# EAGLE design VertMount (EAGLE 9.6.2)
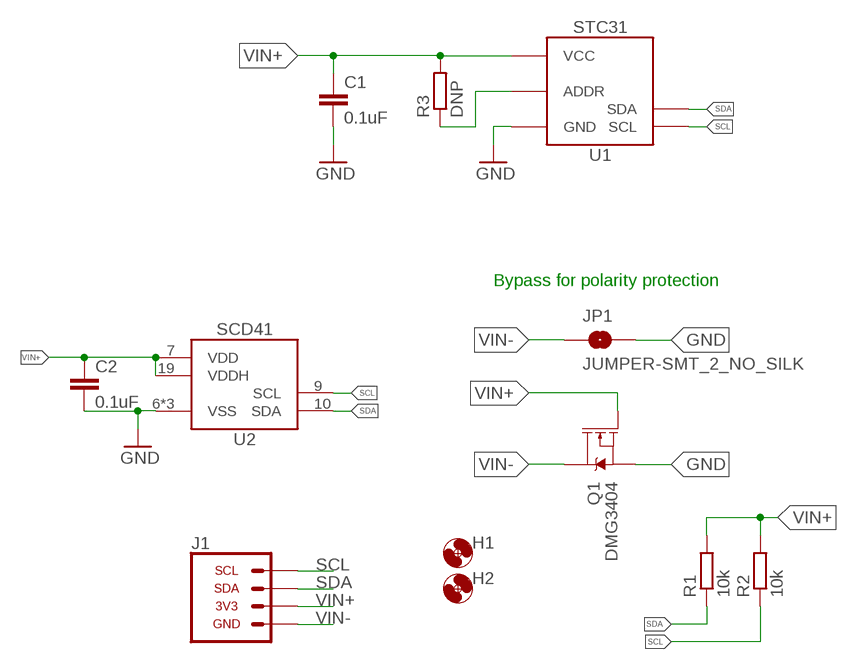
[diagram p0: schematic, sheet 1]

## Parts
C1  0.1uF  C-EU0.1UFC0603  [C0603]
C2  0.1uF  C-EU0.1UFC0603  [C0603]
H1  MOUNTING_HOLE1_NP  [1_72]
H2  MOUNTING_HOLE1_NP  [1_72]
J1  CONN_I2C_SENSOR_BOARD_MOUNT_TH  [1X04_M12_TE_T41400]
JP1  JUMPER-SMT_2_NO_SILK  [SMT-JUMPER_2_NO_SILK]
Q1  DMG3404  MOSFET-NCH-DMG3404L  [SOT23-3]
R1  10k  R-EU_10KR0603  [R0603]
R2  10k  R-EU_10KR0603  [R0603]
R3  DNP  R-EU_R0603  [R0603]
U1  STC31  [STC31]
U2  SCD41  [SCD4X]

## Nets
GND: C1.2 C2.2 JP1.2 Q1.2(S) U1.1(GND) U1.5(GND) U1.9(GND) U1.11(GND) U1.EP(GND) U2.6(VSS) U2.20(VSS) U2.EP(VSS)
N$2: R3.1 U1.3(ADDR)
SCL: J1.3(SCL) R2.1 U1.4(SCL) U2.9(SCL)
SDA: J1.1(SDA) R1.1 U1.7(SDA) U2.10(SDA)
VIN+: C1.1 C2.1 J1.2(3V3) Q1.1(G) R1.2 R2.2 R3.2 U1.6(VCC) U2.7(VDD) U2.19(VDDH)
VIN-: J1.4(GND) JP1.1 Q1.3(D)

## Notes on the sheet
- Bypass for polarity protection

## Library data of the parts
C1 C2 = bschulz_passives:C-EU: CAPACITOR, European symbol; DIGIKEY: 490-6051-1-ND; MF: Murata; MPN: GCM188R71E104KA57D
H1 H2 = bschulz:MOUNTING_HOLE: Genaric Mechanical Mounting Hole Hole diameter based on max body diameter + 15% Keepout ring is for diameter of socket cap screw (minimum required clearance) TPlace ring is for diameter of pan head screw (recomended clearance) Specifications: Socket Cap <http://fastener-express.com/fastener-technical/SocketscapSS-Alloy.pdf> Button Head Socket Cap <http://fastener-express.com/fastener-technical/Button-Socket-alloy.pdf> Pan Head <http://fastener-express.com/fastener-technical/pan-machine-Screws.pdf>; DIGIKEY: DNP; MF: N/A; MPN: DNP
J1 = GEMS_Plugs:CONN_I2C_SENSOR: GEMS Connector for I2C Devices - Sensor Side; DIGIKEY: A124956-ND; MF: TE; MPN: T4140012041-000
JP1 = bschulz:JUMPER-SMT_2_NO: Normally open jumper This jumper has two pads in close proximity to each other. Apply solder to close the connection. Round pads are easier to solder for beginners, but are a lot larger. SparkFun Product that uses the round pads: SparkFun EL Sequencer <https://www.sparkfun.com/products/12781>; DIGIKEY: DNP; MF: N/A; MPN: N/A
Q1 = bschulz:MOSFET-NCH: N-channel MOSFETs Voltage controlled devices that allow control of high current outputs. SparkFun Products: SparkFun OpenScale <https://www.sparkfun.com/products/13261> SparkFun Digital Sandbox <https://www.sparkfun.com/products/12651> SparkFun Monster Moto Shield <https://www.sparkfun.com/products/10182> SparkFun MOSFET Power Controller <https://www.sparkfun.com/products/11214>; DIGIKEY: DMG3404L-7DICT-ND; MF: Diodes Incorporated; MPN: DMG3404L-7
R1 R2 = bschulz_passives:R-EU_: RESISTOR, European symbol Digikey Parts: Yageo, 0402 <https://www.digikey.com/products/en/resistors/chip-resistor-surface-mount/52?k=&pkeyword=&sv=0&s=4356&sf=1&FV=-1%7C13%2C7%7C2%2C1291%7C39157%2C1989%7C0%2C-8%7C52%2C3%7C1131%2C3%7C2503&quantity=&ColumnSort=0&page=1&stock=1&pageSize=25> Yageo, 0603 <https://www.digikey.com/products/en/resistors/chip-resistor-surface-mount/52?k=&pkeyword=&sv=0&pv1291=39245&sf=1&FV=-5%7C4356%2C-5%7C47360%2C-8%7C52%2C-1%7C13%2C7%7C2%2C1989%7C0&quantity=10&ColumnSort=1000011&page=1&stock=1&pageSize=25> Panasonic, 0603 <https://www.digikey.com/products/en/resistors/chip-resistor-surface-mount/52?k=&pkeyword=&pv252=68&sf=0&FV=ffec373d%2C1c0002%2C142c040c%2C1f140000%2Cffe00034%2C80002%2Cc0001&quantity=&ColumnSort=0&page=1&stock=1&pageSize=25> Panasonic, precision, 0603 <https://www.digikey.com/products/en/resistors/chip-resistor-surface-mount/52?FV=ffec4907%2Cfffc000a%2Cc0172%2C142c040c%2C1f140000%2Cffe00034%2C1c0002&quantity=100&ColumnSort=2085&page=1&stock=1&pageSize=25> Panasonic, 0805 <https://www.digikey.com/products/en/resistors/chip-resistor-surface-mount/52?k=&pkeyword=&pv3=1&sf=0&FV=ffec373d%2C1c0002%2C1f140000%2Cffe00034%2C142c040d&quantity=&ColumnSort=0&page=1&stock=1&pageSize=25> Rohm, current sense <https://www.digikey.com/products/en/resistors/chip-resistor-surface-mount/52?k=&pkeyword=&pv3=1&sf=0&FV=ffecb688%2C1f140000%2Cffe00034%2C1c0002&quantity=&ColumnSort=0&page=1&stock=1&pageSize=25> Vishay, pulse proof automotive <https://www.digikey.com/products/en/resistors/chip-resistor-surface-mount/52?k=&pkeyword=&pv7=2&sf=0&FV=ffec5d6b%2Cffe00034%2C1f140000&quantity=&ColumnSort=0&page=1&stock=1&pageSize=25>; DIGIKEY: 311-10.0KHRCT-ND; MF: Yageo; MPN: RC0603FR-0710KL; VALUE_PART: 10k
R3 = bschulz_passives:R-EU_: RESISTOR, European symbol Digikey Parts: Yageo, 0402 <https://www.digikey.com/products/en/resistors/chip-resistor-surface-mount/52?k=&pkeyword=&sv=0&s=4356&sf=1&FV=-1%7C13%2C7%7C2%2C1291%7C39157%2C1989%7C0%2C-8%7C52%2C3%7C1131%2C3%7C2503&quantity=&ColumnSort=0&page=1&stock=1&pageSize=25> Yageo, 0603 <https://www.digikey.com/products/en/resistors/chip-resistor-surface-mount/52?k=&pkeyword=&sv=0&pv1291=39245&sf=1&FV=-5%7C4356%2C-5%7C47360%2C-8%7C52%2C-1%7C13%2C7%7C2%2C1989%7C0&quantity=10&ColumnSort=1000011&page=1&stock=1&pageSize=25> Panasonic, 0603 <https://www.digikey.com/products/en/resistors/chip-resistor-surface-mount/52?k=&pkeyword=&pv252=68&sf=0&FV=ffec373d%2C1c0002%2C142c040c%2C1f140000%2Cffe00034%2C80002%2Cc0001&quantity=&ColumnSort=0&page=1&stock=1&pageSize=25> Panasonic, precision, 0603 <https://www.digikey.com/products/en/resistors/chip-resistor-surface-mount/52?FV=ffec4907%2Cfffc000a%2Cc0172%2C142c040c%2C1f140000%2Cffe00034%2C1c0002&quantity=100&ColumnSort=2085&page=1&stock=1&pageSize=25> Panasonic, 0805 <https://www.digikey.com/products/en/resistors/chip-resistor-surface-mount/52?k=&pkeyword=&pv3=1&sf=0&FV=ffec373d%2C1c0002%2C1f140000%2Cffe00034%2C142c040d&quantity=&ColumnSort=0&page=1&stock=1&pageSize=25> Rohm, current sense <https://www.digikey.com/products/en/resistors/chip-resistor-surface-mount/52?k=&pkeyword=&pv3=1&sf=0&FV=ffecb688%2C1f140000%2Cffe00034%2C1c0002&quantity=&ColumnSort=0&page=1&stock=1&pageSize=25> Vishay, pulse proof automotive <https://www.digikey.com/products/en/resistors/chip-resistor-surface-mount/52?k=&pkeyword=&pv7=2&sf=0&FV=ffec5d6b%2Cffe00034%2C1f140000&quantity=&ColumnSort=0&page=1&stock=1&pageSize=25>; MF: Yageo
U1 = bschulz:STC31: STC31 - Thermal Conductivity CO2 Gas Sensor Sensor Characteristics: Vcc: 2.7 ~ 5.5V Sensing: CO2, Temperature Range: 0 ~ 100% (CO2) Sample Rate: >1Hz Operating Temperature: -40°C to 105°C Digikey: 1649-STC31-C-R3CT-ND <https://www.digikey.com/en/products/detail/sensirion-ag/STC31-C-R3/24394079>; DIGIKEY: 1649-STC31-C-R3CT-ND; DISP: STC31; MF: Sensirion; MPN: STC31-C-R3
U2 = bschulz:SCD4*: SCD4x - Miniature NDIR CO2 Sensor Characteristics: Vcc: 2.4 ~ 5.5V Sensing: CO2, Temperature, Humidity Range: 0 ~ 40000 ppm (CO2) Sample Rate: <5s Operating Temperature: -10°C to 60°C Digikey: 1649-SCD40-D-R2CT-ND <https://www.digikey.com/en/products/detail/sensirion-ag/SCD40-D-R2/13684003> 1649-SCD41-D-R2CT-ND <https://www.digikey.com/en/products/detail/sensirion-ag/SCD41-D-R2/13684005>; DIGIKEY: 1649-SCD41-D-R2CT-ND; DISP: SCD41; MF: Sensirion; MPN: SCD41-D-R2

## Board
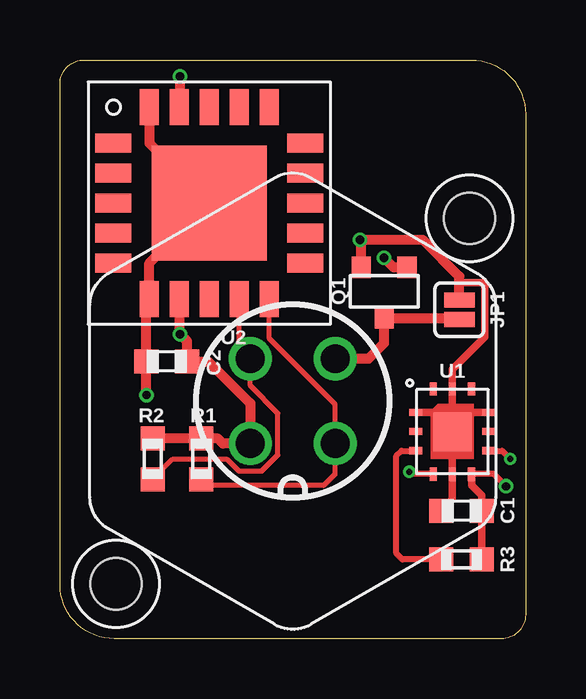
[diagram p1: board, top side]
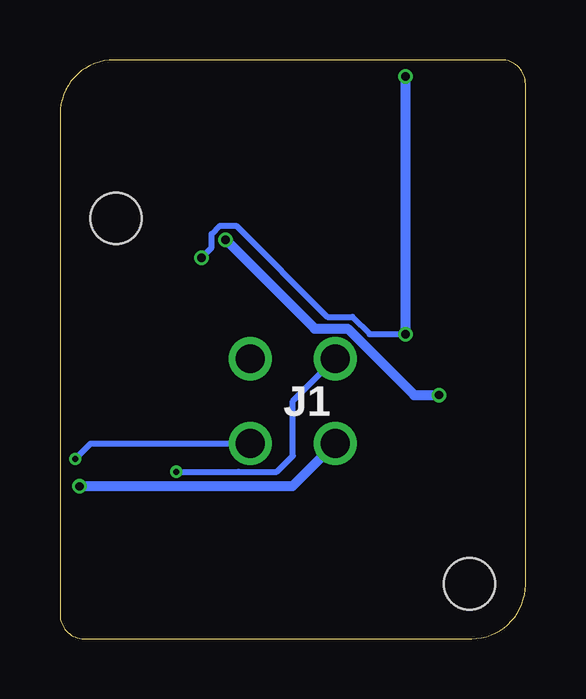
[diagram p2: board, bottom side, seen from below]

Size 19.4 x 24.13 mm. Coordinates in mm from the lower left corner, seen from the top.
Outline: 19.4,21.88 19.4,1 arc-90 18.4,0 2.25,0 arc-90 0,2.25 0,23.13 arc-90 1,24.13 17.15,24.13 arc-90 19.4,21.88
Copper layers (1*16): Top 0.035559375mm / dielectric 1.6mm / Bottom 0.035559375mm
Design rules "jlcpcb-2layer": minimum track width 5mil, minimum drill 0.2mm, track to track 5mil, track to pad 6mil, pad to pad 5mil, via to via 6mil, smd to smd 5mil, copper to edge 15mil, drill to drill 6mil, minimum pad ring 5mil, minimum via ring 5mil, stop-mask expansion 2.5mil, vias tented up to drill 0mil, thermal gap 10mil

### Footprints (pad centres in the part's own frame; a part is rotated, then mirrored left to right if it is on the bottom)
C0603 = smd 1 x 1: 1 -0.85,0; 2 0.85,0
1_72 = hole 2.132: 0,0
1X04_M12_TE_T41400 = drill 1.2: 1 1.768,1.768; 2 -1.768,1.768; 3 -1.768,-1.768; 4 1.768,-1.768
SMT-JUMPER_2_NO_SILK = smd 0.635 x 1.27: 1 -0.406,0; 2 0.406,0
SOT23-3 = smd 0.8 x 0.9: 1 -0.95,-1; 2 0.95,-1; 3 0,1.1
R0603 = smd 1 x 1: 1 -0.85,0; 2 0.85,0
STC31 = smd 0.55 x 0.3: 1 -1.525,0.8; 2 -1.525,0; 3 -1.525,-0.8; 7 1.525,-0.8; 8 1.525,0; 9 1.525,0.8 | smd 0.3 x 0.55: 4 -0.8,-1.775; 5 0,-1.775; 6 0.8,-1.775; 10 0.8,1.775; 11 0,1.775; 12 -0.8,1.775 | smd 1.6 x 1.6: EP 0,0
SCD4X = smd 1.5 x 0.8: 1 -4,2.5; 2 -4,1.25; 3 -4,0; 4 -4,-1.25; 5 -4,-2.5; 11 4,-2.5; 12 4,-1.25; 13 4,0; 14 4,1.25; 15 4,2.5 | smd 0.8 x 1.5: 6 -2.5,-4; 7 -1.25,-4; 8 0,-4; 9 1.25,-4; 10 2.5,-4; 16 2.5,4; 17 1.25,4; 18 0,4; 19 -1.25,4; 20 -2.5,4 | smd 4.8 x 4.8: EP 0,0

### Placement (x,y rotation side)
C1  16.73,5.33 180 top
C2  4.45,11.56 180 top
H1  17.06,17.53 0 top
H2  2.33,2.29 0 top
J1  9.7,9.91 180 bottom
JP1  16.64,13.72 90 top
Q1  13.51,14.48 180 top
R1  5.89,7.49 90 top
R2  3.86,7.49 90 top
R3  16.73,3.3 0 top
U1  16.35,8.64 0 top
U2  6.22,18.16 0 top

### Tracks (layer width: path | path; a pad name or v marks a point on that pad's centre or on a via)
GND  (via drill 0.35)
  Top 0.305: C1.2 16.35,5.8 U1.5 U1.EP | U1.1 15.55,9.44 U1.EP | U1.EP U1.11 16.35,11.22 17.7,12.57 17.7,14.73 17.57,14.86 16.64,14.86 | U1.9 17.15,9.44 U1.EP
  Top 0.406: U2.20 3.72,20.66 U2.EP 3.72,15.66 U2.6 3.6,14.03 C2.2 v3.6,10.16 | Q1.2 12.56,16.57 v12.49,16.64 15.11,16.64 16.64,15.11 16.64,14.86 JP1.2
  Bottom 0.406: v12.49,16.64 8.78,12.93 7.41,12.93 4.64,10.16 v3.6,10.16
N$2
  Top 0.254: R3.1 14.27,3.3 14.02,3.56 14.02,7.62 14.23,7.84 U1.3
SCL  (via drill 0.25)
  Top 0.2: U2.9 7.47,12.13 J1.3 7.93,10.55 9.08,9.4 9.08,7.66 8.41,6.99 8.05,6.99 7.45,6.99 6.95,7.49 4.71,7.49 R2.1
  Top 0.254: U1.4 14.65,6.86 v14.55,6.96
  Bottom 0.254: v14.55,6.96 11.96,6.96 11.95,6.96 10.36,6.96 9.7,7.62 9.7,9.91 J1.3
SDA  (via drill 0.25)
  Top 0.2: U2.10 8.72,12.51 11.47,9.77 J1.1 11.47,6.87 10.99,6.39 6.14,6.39 R1.1
  Top 0.254: U1.7 18.42,7.84 v18.76,7.49
  Bottom 0.254: v18.76,7.49 18.12,8.14 J1.1
VIN+  (via drill 0.35)
  Top 0.254: v18.59,6.35 18.08,6.86 U1.6
  Top 0.305: R3.2 C1.1 17.58,5.97 17.15,6.4 U1.6
  Top 0.406: R2.2 R1.2 6.58,8.34 6.79,8.14 J1.2 7.93,9.81 6.18,11.56 C2.1 5.3,12.4 v5,12.7 5,14.13 U2.7 | v5,23.45 5,22.19 U2.19 | Q1.1 13.91,15.48 v13.51,15.88
  Bottom 0.254: v13.51,15.88 13.07,16.31 13.07,16.88 12.73,17.22 12.06,17.22 8.25,13.41 7.21,13.41 6.5,12.7 v5,12.7
  Bottom 0.406: v5,12.7 v5,23.45 | J1.2 9.72,6.35 v18.59,6.35
VIN-
  Top 0.406: J1.4 12.86,11.67 13.51,12.32 Q1.3 16.57,13.38 JP1.1

### Text on the board
tDocu: Project Hedorah / Mk3A / SCD41/STC31 / v0.0
bDocu: Creature of Slime and Sludge / Spawned by Pollution's Poison / Threatens to Destroy the Earth!